# EAGLE schematic Enclosure 85x58 SC2A (EAGLE 9.6.2)
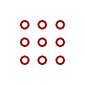
[diagram p0: schematic, sheet 1]

## Parts
U$1  PROTO-28X18-S2A  [PROTO-28X18-S2A]

## Library data of the parts
U$1 = digitalconcepts:PROTO-28X18-S2A: 28 x 18 Prototyping board to fit an 85 x 58 enclosure, with external connector cut-outs